# Altium project beovox-poe.PrjPcb
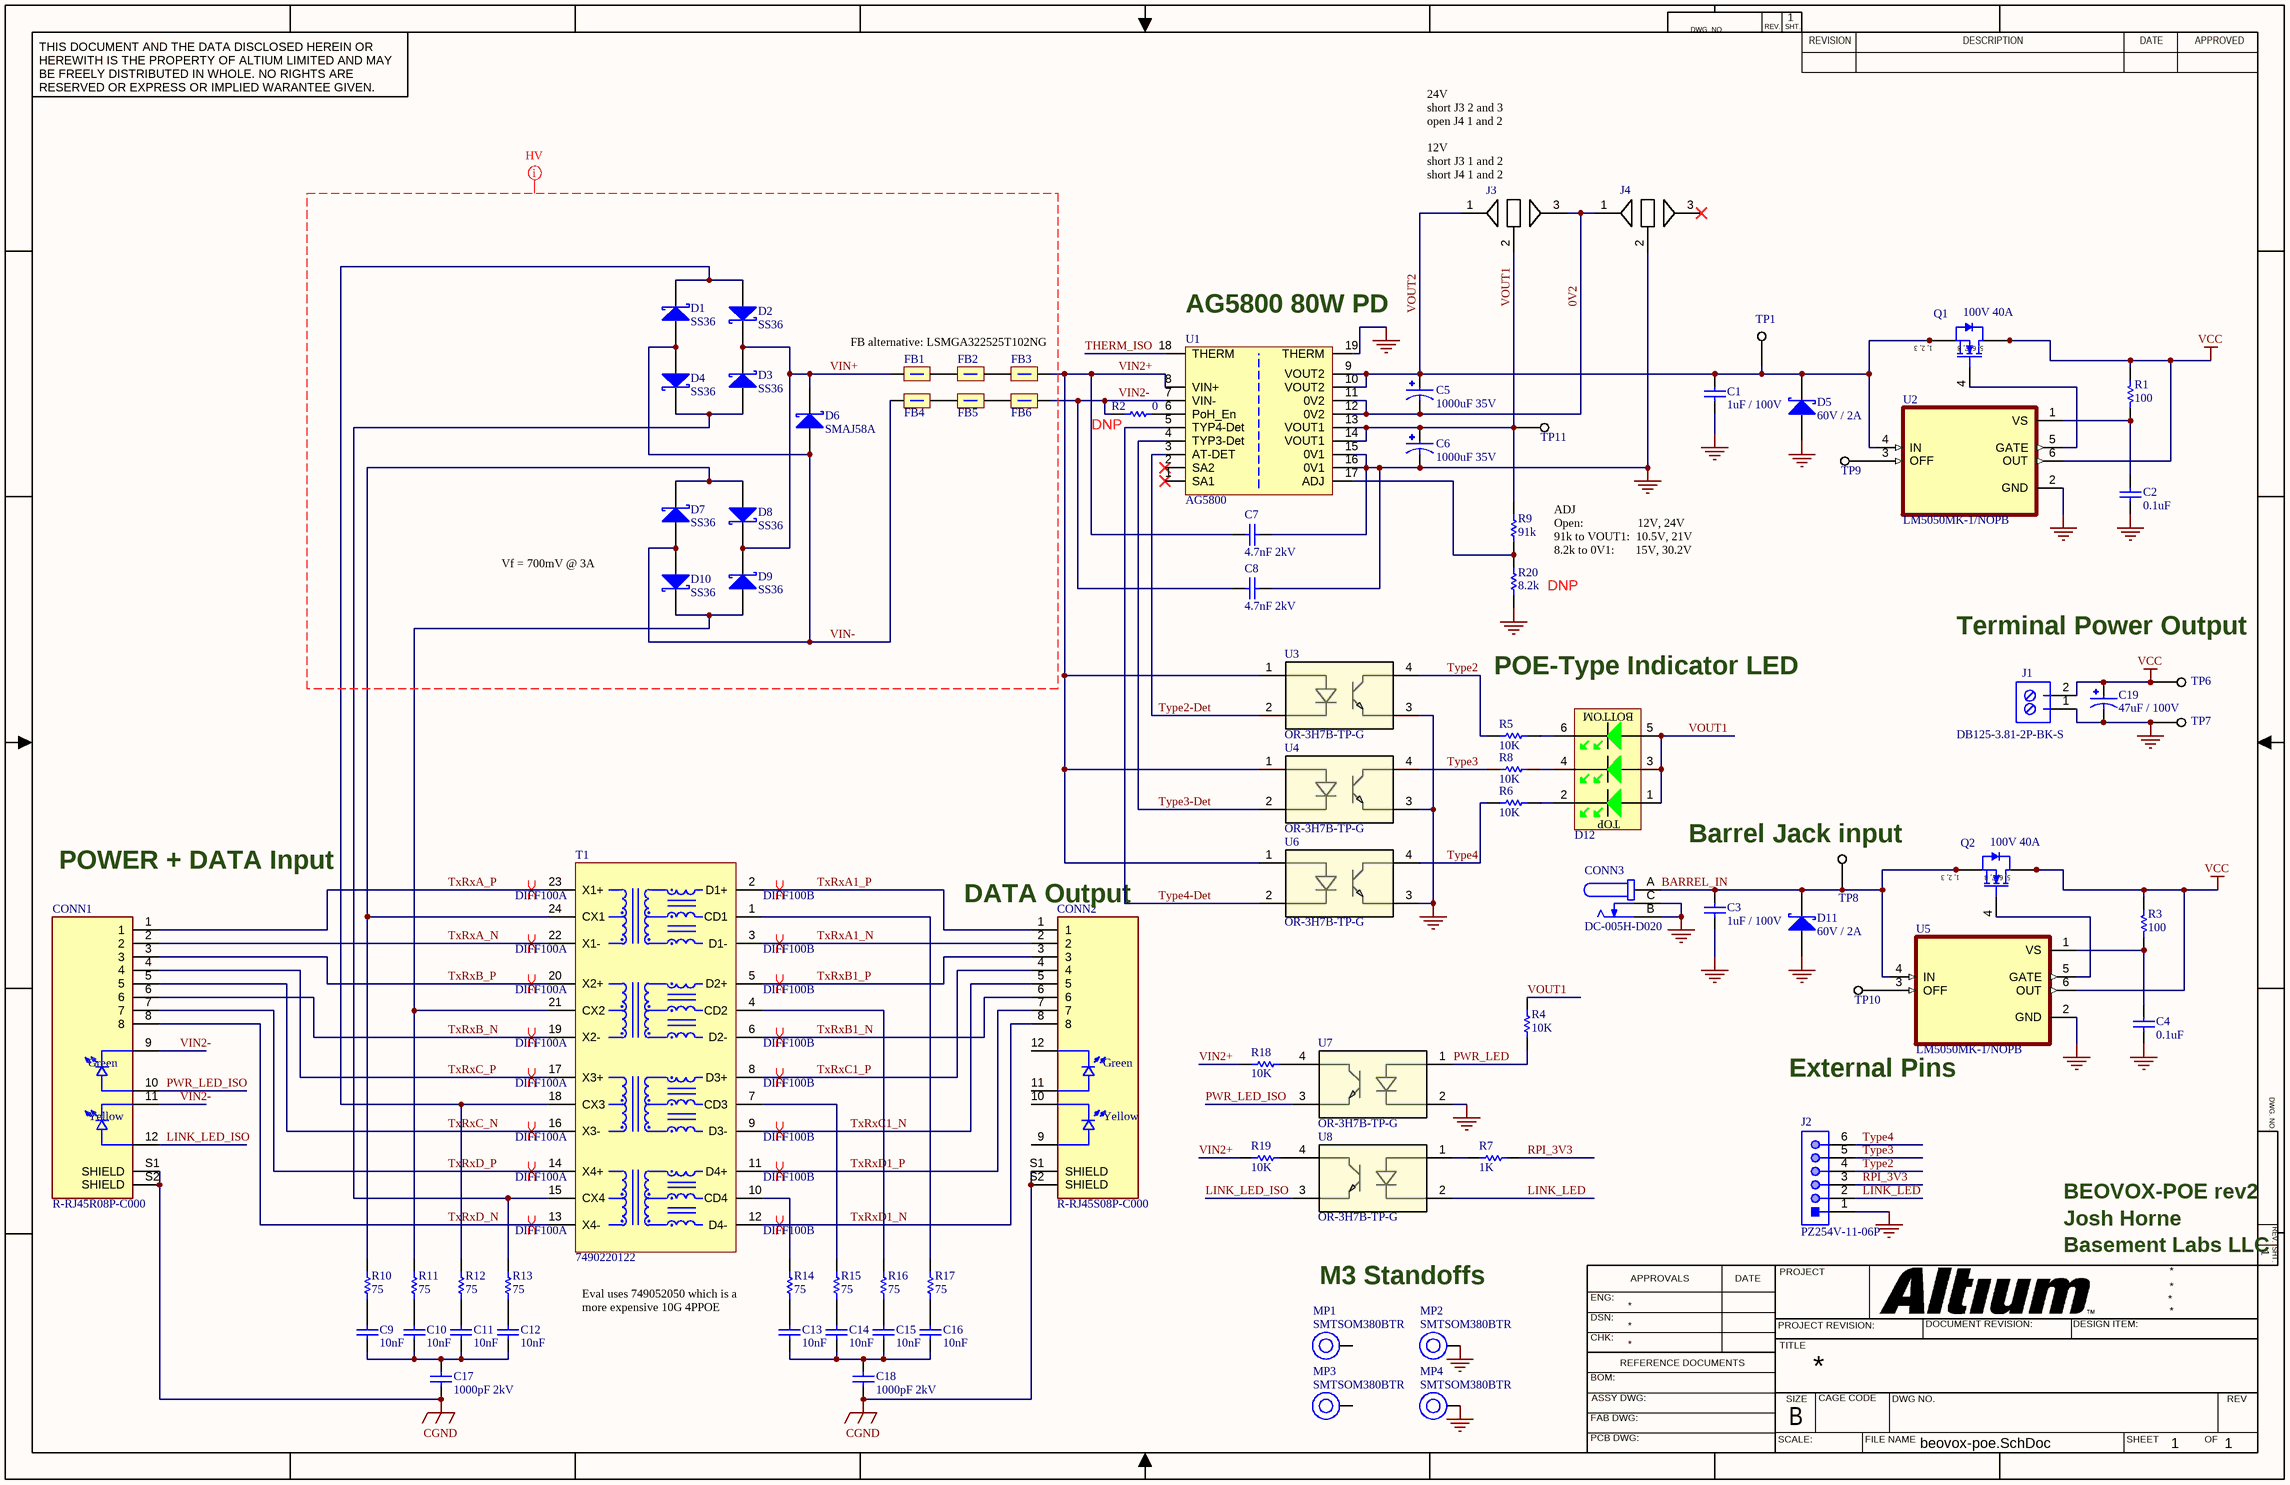
[diagram p0: beovox-poe.SchDoc]
PCB_ENGINEER: JOSH HORNE; PCB_TITLE_1: BEOVOX-POE; PCB_TITLE_2: REV1
1 sheet, 86 parts. Net scope: global (net labels, ports and power ports of the same name join across sheets).
Board file: beovox-poe.PcbDoc

## Sheet beovox-poe.SchDoc
size 431 x 279 mm; SheetNumber: 1; SheetTotal: 1

### Parts
C1  1uF / 100V  [CAP_1210]
C2  0.1uF  [CAP_0603_SK]
C3  1uF / 100V  [CAP_1210]
C4  0.1uF  [CAP_0603_SK]
C5  1000uF 35V  [CAP_TH_5_10X20]
C6  1000uF 35V  [CAP_TH_5_10X20]
C7  4.7nF 2kV  [CAP_1206_SK]
C8  4.7nF 2kV  [CAP_1206_SK]
C9  10nF  [CAP_0603_SK]
C10  10nF  [CAP_0603_SK]
C11  10nF  [CAP_0603_SK]
C12  10nF  [CAP_0603_SK]
C13  10nF  [CAP_0603_SK]
C14  10nF  [CAP_0603_SK]
C15  10nF  [CAP_0603_SK]
C16  10nF  [CAP_0603_SK]
C17  1000pF 2kV  [CAP_1206_SK]
C18  1000pF 2kV  [CAP_1206_SK]
C19  47uF / 100V  [CAP_TH_3.5_8_12]
CONN1  R-RJ45R08P-C000  [R-RJ45R08P-C000]
CONN2  R-RJ45S08P-C000  [CONN_RJ45_R-RJ45S08P-C000]
CONN3  DC-005H-D020  [TENSILITY_54-00166]
D1  SS36  [DIOD-SMA-2_V]
D2  SS36  [DIOD-SMA-2_V]
D3  SS36  [DIOD-SMA-2_V]
D4  SS36  [DIOD-SMA-2_V]
D5  60V / 2A  [DIOD-B360A_V]
D6  SMAJ58A  [DIOD-SMA-2_V]
D7  SS36  [DIOD-SMA-2_V]
D8  SS36  [DIOD-SMA-2_V]
D9  SS36  [DIOD-SMA-2_V]
D10  SS36  [DIOD-SMA-2_V]
D11  60V / 2A  [DIOD-B360A_V]
D12  3 Diode Vertical LED Green  [MHK33147CGBTD]  (value not drawn)
FB1  MPZ2012S601AT000  [FB0805]  (value not drawn)
FB2  MPZ2012S601AT000  [FB0805]  (value not drawn)
FB3  MPZ2012S601AT000  [FB0805]  (value not drawn)
FB4  MPZ2012S601AT000  [FB0805]  (value not drawn)
FB5  MPZ2012S601AT000  [FB0805]  (value not drawn)
FB6  MPZ2012S601AT000  [FB0805]  (value not drawn)
J1  DB125-3.81-2P-BK-S  [TERM_2x1_3.81_BLK]
J2  PZ254V-11-06P  [HDR_MALE_1X6_2.54]
J3  JUMPER  [SOLDER_JUMPER_3 large]  (value not drawn)
J4  JUMPER  [SOLDER_JUMPER_3 large]  (value not drawn)
MP1  SMTSOM380BTR  [SMTSOM380_PlatedScrew]
MP2  SMTSOM380BTR  [SMTSOM380_PlatedScrew]
MP3  SMTSOM380BTR  [SMTSOM380_PlatedScrew]
MP4  SMTSOM380BTR  [SMTSOM380_PlatedScrew]
Q1  100V 40A  [TRANS_8PowerTDFN]
Q2  100V 40A  [TRANS_8PowerTDFN]
R1  100  [RES_0603]
R2  0  [RES_0805]
R3  100  [RES_0603]
R4  10K  [RES_0603]
R5  10K  [RES_0603]
R6  10K  [RES_0603]
R7  1K  [RES_0603]
R8  10K  [RES_0603]
R9  91k  [RES_0603]
R10  75  [RES_0603]
R11  75  [RES_0603]
R12  75  [RES_0603]
R13  75  [RES_0603]
R14  75  [RES_0603]
R15  75  [RES_0603]
R16  75  [RES_0603]
R17  75  [RES_0603]
R18  10K  [RES_0603]
R19  10K  [RES_0603]
R20  8.2k  [RES_0603]
T1  7490220122  [XFMR_7490220122]
TP1  TP  [Test_Point]  (value not drawn)  (no BOM)
TP6  TP  [Test_Point]  (value not drawn)  (no BOM)
TP7  TP  [Test_Point]  (value not drawn)  (no BOM)
TP8  TP  [Test_Point]  (value not drawn)  (no BOM)
TP9  TP  [Test_Point]  (value not drawn)  (no BOM)
TP10  TP  [Test_Point]  (value not drawn)  (no BOM)
TP11  TP  [Test_Point]  (value not drawn)  (no BOM)
U1  AG5800  [AG5800]
U2  LM5050MK-1/NOPB  [SOT95P280X110-6N]
U3  OR-3H7B-TP-G  [SOIC_(B)(TA)-VG_EVS]
U4  OR-3H7B-TP-G  [SOIC_(B)(TA)-VG_EVS]
U5  LM5050MK-1/NOPB  [SOT95P280X110-6N]
U6  OR-3H7B-TP-G  [SOIC_(B)(TA)-VG_EVS]
U7  OR-3H7B-TP-G  [SOIC_(B)(TA)-VG_EVS]
U8  OR-3H7B-TP-G  [SOIC_(B)(TA)-VG_EVS]

### Nets
CGND: C17.1 C18.1 CONN1.S1(SHIELD) CONN1.S2(SHIELD) CONN2.S1(SHIELD) CONN2.S2(SHIELD)
GND: C1.1 C2.1 C3.1 C4.1 C6.N C7.2 C8.2 C19.N CONN3.B CONN3.C D5.1(A) D11.1(A) J1.1 J2.1 J4.2 MP2.1 MP4.1 R20.1 TP7.1 U1.15(0V1) U1.16(0V1) U1.19(THERM) U2.2(GND) U3.3 U4.3 U5.2(GND) U6.3 U7.2
VCC: C19.P J1.2 Q1.5(DRAIN) Q1.6(DRAIN) Q1.7(DRAIN) Q1.8(DRAIN) Q2.5(DRAIN) Q2.6(DRAIN) Q2.7(DRAIN) Q2.8(DRAIN) R1.2 R3.2 TP6.1 U2.6(OUT) U5.6(OUT)
0V2: C5.N J3.3 J4.1 U1.11(0V2) U1.12(0V2)
BARREL_IN: C3.2 CONN3.A D11.2(K) Q2.1(SOURCE) Q2.2(SOURCE) Q2.3(SOURCE) TP8.1 U5.4(IN)
LINK_LED: J2.2 U8.2
LINK_LED_ISO: CONN1.12 U8.3
PWR_LED: R4.1 U7.1
PWR_LED_ISO: CONN1.10 U7.3
RPI_3V3: J2.3 R7.1
THERM_ISO: U1.18(THERM)
TxRxA1_N: CONN2.2 T1.3(D1-)
TxRxA1_P: CONN2.1 T1.2(D1+)
TxRxA_N: CONN1.2 T1.22(X1-)
TxRxA_P: CONN1.1 T1.23(X1+)
TxRxB1_N: CONN2.6 T1.6(D2-)
TxRxB1_P: CONN2.3 T1.5(D2+)
TxRxB_N: CONN1.6 T1.19(X2-)
TxRxB_P: CONN1.3 T1.20(X2+)
TxRxC1_N: CONN2.5 T1.9(D3-)
TxRxC1_P: CONN2.4 T1.8(D3+)
TxRxC_N: CONN1.5 T1.16(X3-)
TxRxC_P: CONN1.4 T1.17(X3+)
TxRxD1_N: CONN2.8 T1.12(D4-)
TxRxD1_P: CONN2.7 T1.11(D4+)
TxRxD_N: CONN1.8 T1.13(X4-)
TxRxD_P: CONN1.7 T1.14(X4+)
Type2: J2.4 R5.2 U3.4
Type2-Det: U1.3(AT-DET) U3.2
Type3: J2.5 R8.2 U4.4
Type3-Det: U1.4(TYP3-Det) U4.2
Type4: J2.6 R6.2 U6.4
Type4-Det: U1.5(TYP4-Det) U6.2
VIN2+: C7.1 FB3.2 R18.2 R19.2 U1.8(VIN+) U3.1 U4.1 U6.1
VIN2-: C8.1 CONN1.9 CONN1.11 FB6.2 R2.1 U1.7(VIN-)
VIN+: D2.2(K) D3.2(K) D6.2(K) D8.2(K) D9.2(K) FB1.1
VIN-: D1.1(A) D4.1(A) D6.1(A) D7.1(A) D10.1(A) FB4.1
VOUT1: C6.P D12.1 D12.3 D12.5 J3.2 R4.2 R9.1 TP11.1 U1.13(VOUT1) U1.14(VOUT1)
VOUT2: C1.2 C5.P D5.2(K) J3.1 Q1.1(SOURCE) Q1.2(SOURCE) Q1.3(SOURCE) TP1.1 U1.9(VOUT2) U1.10(VOUT2) U2.4(IN)
NetC2_2: C2.2 R1.1 U2.1(VS)
NetC4_2: C4.2 R3.1 U5.1(VS)
NetC9_1: C9.1 C10.1 C11.1 C12.1 C17.2
NetC9_2: C9.2 R10.1
NetC10_2: C10.2 R11.1
NetC11_2: C11.2 R12.1
NetC12_2: C12.2 R13.1
NetC13_1: C13.1 C14.1 C15.1 C16.1 C18.2
NetC13_2: C13.2 R14.1
NetC14_2: C14.2 R15.1
NetC15_2: C15.2 R16.1
NetC16_2: C16.2 R17.1
NetD1_2: D1.2(K) D2.1(A) R12.2 T1.18(CX3)
NetD3_1: D3.1(A) D4.2(K) R13.2 T1.15(CX4)
NetD7_2: D7.2(K) D8.1(A) R10.2 T1.24(CX1)
NetD9_1: D9.1(A) D10.2(K) R11.2 T1.21(CX2)
NetD12_2: D12.2 R6.1
NetD12_4: D12.4 R8.1
NetD12_6: D12.6 R5.1
NetFB1_2: FB1.2 FB2.1
NetFB2_2: FB2.2 FB3.1
NetFB4_2: FB4.2 FB5.1
NetFB5_2: FB5.2 FB6.1
NetQ1_4: Q1.4(GATE) U2.5(GATE)
NetQ2_4: Q2.4(GATE) U5.5(GATE)
NetR2_2: R2.2 U1.6(PoH_En)
NetR7_2: R7.2 U8.1
NetR9_2: R9.2 R20.2 U1.17(ADJ)
NetR14_2: R14.2 T1.10(CD4)
NetR15_2: R15.2 T1.7(CD3)
NetR16_2: R16.2 T1.4(CD2)
NetR17_2: R17.2 T1.1(CD1)
NetR18_1: R18.1 U7.4
NetR19_1: R19.1 U8.4
NetTP9_1: TP9.1 U2.3(OFF)
NetTP10_1: TP10.1 U5.3(OFF)

Not connected (* = marked no-connect by the designer): CONN2 9 10 11 12; J4 3*; MP1 1; MP3 1; U1 1(SA1)* 2(SA2)*

### Layout directives
net class HV: VIN+, VIN-
differential pair; differential pair class DIFF100A: TxRxA_N, TxRxA_P, TxRxB_N, TxRxB_P, TxRxC_N, TxRxC_P, TxRxD_N, TxRxD_P
differential pair; differential pair class DIFF100B: TxRxA1_N, TxRxA1_P, TxRxB1_N, TxRxB1_P, TxRxC1_N, TxRxC1_P, TxRxD1_N, TxRxD1_P

### Notes on the sheet
- (near J3) 24V
  short J3 2 and 3
  open J4 1 and 2
  12V
  short J3 1 and 2
  short J4 1 and 2
- FB alternative: LSMGA322525T102NG
- (near U1) AG5800 80W PD
- (near R2) DNP
- ADJ
  Open:                  12V, 24V
  91k to VOUT1:  10.5V, 21V
  8.2k to 0V1:       15V, 30.2V
- Vf = 700mV @ 3A
- DNP
- POE-Type Indicator LED
- Terminal Power Output
- POWER + DATA Input
- (near TP8) Barrel Jack input
- (near CONN2) DATA Output
- External Pins
- BEOVOX-POE rev2
- Josh Horne
- M3 Standoffs
- Basement Labs LLC
- Eval uses 749052050 which is a more expensive 10G 4PPOE
- DWG. NO.
- REV.
- SHT.
- THIS DOCUMENT AND THE DATA DISCLOSED HEREIN OR HEREWITH IS THE PROPERTY OF ALTIUM LIMITED AND MAY BE FREELY DISTRIBUTED IN WHOLE. NO RIGHTS ARE RESERVED OR EXPRESS OR IMPLIED WARANTEE GIVEN.
- REVISION
- DESCRIPTION
- DATE
- APPROVED
- ENG:
- APPROVALS
- PROJECT
- DSN:
- CHK:
- REFERENCE DOCUMENTS
- PROJECT REVISION:
- TITLE
- DOCUMENT REVISION:
- DESIGN ITEM:
- BOM:
- FAB DWG:
- PCB DWG:
- ASSY DWG:
- SCALE:
- SIZE
- B
- CAGE CODE
- FILE NAME
- DWG NO.
- SHEET
- OF
- REV
- (in symbol BSZ097N10NS5ATMA1) 1, 2, 3; 5, 6, 7, 8
- (in symbol MHK33147CGBTD) BOTTOM; TOP
- (in symbol R-RJ45R08P-C000) Green; Yellow
- (in symbol R-RJ45S08P-C000) Green; Yellow

### Library data of the parts
C1 C3 = GRM32ER72A105KA01L: 1210 1 uF 100 V ±10% Tolerance X7R SMT Multilayer Ceramic Capacitor; Manufacturer: Murata; Supplier 1: Avnet; Manufacturer Part Number: GRM32ER72A105KA01L; RoHS: Yes; Category: Ceramic Capacitors; Stock 1: 22500; Pricing 1: 1000=0.33337, 2000=0.32553, 4000=0.31768, 6000=0.30984, 8000=0.30199 (USD); Mount: Surface Mount; Case/Package: 1210; Number of Pins: 2; Case Code (Imperial): 1210; Case Code (Metric): 3225; Material: Ceramic; Min Operating Temperature: -55°C; Max Operating Temperature: 125°C; Capacitance: 1uF; Tolerance: 10%; Dielectric: X7R; Voltage Rating: 100V; Packaging: Tape and Reel; Package Quantity: 1; Termination: SMD/SMT; Voltage: 100V; Voltage Rating (DC): 100V; Series: GRM; Length: 3.2mm; Width: 0.098inch; Height: 2.5mm; Thickness: 0.106inch; Depth: 2.5mm; Reach SVHC Compliant: Yes; Lead Free: Lead Free; RoHS Compliant: Yes; ComponentLink1URL: https://datasheet.ciiva.com/11789/0900766b80ef921d-11789096.pdf?src-supplier=RSComponents; ComponentLink1Description: https://datasheet.ciiva.com/11789/0900766b80ef921d-11789096.pdf?src-supplier=RSComponents; ComponentLink2URL: https://datasheet.ciiva.com/3777/2750grm32er72a105ka0123-3777235.pdf?src-supplier=Arrow+Electronics; ComponentLink2Description: https://datasheet.ciiva.com/3777/2750grm32er72a105ka0123-3777235.pdf?src-supplier=Arrow+Electronics; ComponentLink3URL: https://datasheet.ciiva.com/29202/451519-da-01-de-vs-kondens-grm32-er72a-105ka01l-29202131.pdf?src-supplier=Conrad; ComponentLink3Description: https://datasheet.ciiva.com/29202/451519-da-01-de-vs-kondens-grm32-er72a-105ka01l-29202131.pdf?src-supplier=Conrad; ComponentLink4URL: https://datasheet.ciiva.com/7937/608985-7937781.pdf?src-supplier=Element14; ComponentLink4Description: https://datasheet.ciiva.com/7937/608985-7937781.pdf?src-supplier=Element14; ComponentLink5URL: https://datasheet.ciiva.com/22703/608985-22703400.pdf?src-supplier=Element14; ComponentLink5Description: https://datasheet.ciiva.com/22703/608985-22703400.pdf?src-supplier=Element14; ComponentLink6URL: https://datasheet.ciiva.com/141/partnumbering-e-01-141963.pdf?src-supplier=Digi-Key; ComponentLink6Description: https://datasheet.ciiva.com/141/partnumbering-e-01-141963.pdf?src-supplier=Digi-Key; ComponentLink7URL: https://datasheet.ciiva.com/141/partnumbering-e-01-141962.pdf?src-supplier=Digi-Key; ComponentLink7Description: https://datasheet.ciiva.com/141/partnumbering-e-01-141962.pdf?src-supplier=Digi-Key; ComponentLink8URL: https://datasheet.ciiva.com/141/partnumbering-e-01-141964.pdf?src-supplier=Digi-Key; ComponentLink8Description: https://datasheet.ciiva.com/141/partnumbering-e-01-141964.pdf?src-supplier=Digi-Key; ComponentLink9URL: https://datasheet.ciiva.com/5415/product-5415622.pdf?src-supplier=Mouser; ComponentLink9Description: https://datasheet.ciiva.com/5415/product-5415622.pdf?src-supplier=Mouser; ComponentLink10URL: https://datasheet.ciiva.com/16376/c02e-16376506.pdf?src-supplier=Future+Electronics; ComponentLink10Description: https://datasheet.ciiva.com/16376/c02e-16376506.pdf?src-supplier=Future+Electronics; Supplier Part Number 1: GRM32ER72A105KA01L
C2 C4 = CC0603KRX7R0BB104: 0603 0.1 uF 100 V ±10% Tolerance X7R Multilayer Ceramic Capacitor; Manufacturer: Yageo; Capacitance: 100nF; Voltage Rating: 100V; Supplier 1: Arrow Electronics; Manufacturer Part Number: CC0603KRX7R0BB104; RoHS: Yes; Category: Ceramic Capacitors; Stock 1: 2; Pricing 1: 1=0.01580 (USD); Mount: Surface Mount; Case/Package: 0603; Case Code (Metric): 1608; Case Code (Imperial): 0603; Weight: 7.1E-05oz; Min Operating Temperature: -55°C; Max Operating Temperature: 125°C; Package Quantity: 4000; Tolerance: 10%; Packaging: Tape and Reel; Dielectric: X7R; Termination: SMD/SMT; Resistor Type: Ceramic; Voltage Rating (DC): 100V; Series: CC; Length: 0.063inch; Width: 0.031inch; Thickness: 0.035inch; Depth: 0.8mm; Lead Free: Lead Free; RoHS Compliant: Yes; ComponentLink1URL: https://datasheet.ciiva.com/6277/mlccorderingcode-6277082.pdf?src-supplier=Digi-Key; ComponentLink1Description: https://datasheet.ciiva.com/6277/mlccorderingcode-6277082.pdf?src-supplier=Digi-Key; ComponentLink2URL: https://datasheet.ciiva.com/6277/mlccorderingcode-6277081.pdf?src-supplier=Digi-Key; ComponentLink2Description: https://datasheet.ciiva.com/6277/mlccorderingcode-6277081.pdf?src-supplier=Digi-Key; ComponentLink3URL: https://datasheet.ciiva.com/6277/mlccorderingcode-6277030.pdf?src-supplier=Digi-Key; ComponentLink3Description: https://datasheet.ciiva.com/6277/mlccorderingcode-6277030.pdf?src-supplier=Digi-Key; Supplier Part Number 1: CC0603KRX7R0BB104; ComponentLink4Description: LCSC; ComponentLink4URL: https://www.lcsc.com/product-detail/Multilayer-Ceramic-Capacitors-MLCC-SMD-SMT_YAGEO-CC0603KRX7R0BB104_C113803.html; Supplier: LCSC; Supplier Part Number: C113803
C5 C6 = ERR1VM102G20OT: 1000uF 35V ±20% Plugin,D10xL20mm Aluminum Electrolytic Capacitors - Leaded ROHS; Manufacturer: AISHI; Supplier: LCSC; Supplier Part Number: C398835; ComponentLink1Description: LCSC; ComponentLink1URL: https://www.lcsc.com/product-detail/Aluminum-Electrolytic-Capacitors-Leaded_AISHI-Aihua-Group-ERR1VM102G20OT_C398835.html; Manufacturer Part Number: ERR1VM102G20OT; Value: 1000uF; Voltage: 35V
C7 C8 = 1206B472K202NT: 2kV 4700pF X7R ±10% 1206 Multilayer Ceramic Capacitors MLCC - SMD/SMT ROHS; Manufacturer: FH (Guangdong Fenghua Advanced Tech); Supplier: LCSC; Supplier Part Number: C41017; Manufacturer Part Number: 1206B472K202NT; ComponentLink1Description: LCSC; ComponentLink1URL: https://www.lcsc.com/product-detail/Multilayer-Ceramic-Capacitors-MLCC-SMD-SMT_FH-Guangdong-Fenghua-Advanced-Tech-1206B472K202NT_C41017.html
C9-C16 = 0603B103K101CT: Multilayer Ceramic Capacitor, 0.01 F, 10%, X7R, 100 V, 0603 [1608 Metric] Rohs Compliant: Yes; Manufacturer: Walsin Technologies; Voltage Rating: 100V; Supplier 1: Arrow Electronics; Manufacturer Part Number: 0603B103K101CT; RoHS: Yes; Category: Ceramic Capacitors; Stock 1: 100000; Pricing 1: 4000=0.00810, 8000=0.00720, 12000=0.00620, 40000=0.00610 (USD); Case/Package: 0603; Case Code (Metric): 1608; Case Code (Imperial): 0603; Min Operating Temperature: -55°C; Max Operating Temperature: 125°C; Capacitance: 10nF; Tolerance: 10%; Packaging: Tape and Reel; Dielectric: X7R; Voltage Rating (DC): 100V; Length: 1.6mm; Depth: 0.8mm; RoHS Compliant: Yes; ComponentLink1URL: http://www.farnell.com/datasheets/2340522.pdf?src-supplier=Farnell; ComponentLink1Description: http://www.farnell.com/datasheets/2340522.pdf?src-supplier=Farnell; ComponentLink2URL: http://www.passivecomponent.com/wp-content/uploads/2018/10/MLCC.pdf?src-supplier=Digi-Key; ComponentLink2Description: http://www.passivecomponent.com/wp-content/uploads/2018/10/MLCC.pdf?src-supplier=Digi-Key; ComponentLink3URL: http://www.passivecomponent.com/indexsea/0603B103K101CT-IS.pdf?src-supplier=Digi-Key; ComponentLink3Description: http://www.passivecomponent.com/indexsea/0603B103K101CT-IS.pdf?src-supplier=Digi-Key; Supplier Part Number 1: 0603B103K101CT; ComponentLink4Description: http://www.farnell.com/datasheets/2340522.pdf?src-supplier=Element14; ComponentLink4URL: http://www.farnell.com/datasheets/2340522.pdf?src-supplier=Element14; Supplier: LCSC; Supplier Part Number: C302008; REACH SVHC: Unknown; ComponentLink5URL: http://www.farnell.com/datasheets/2340522.pdf?src-supplier=Newark; ComponentLink5Description: http://www.farnell.com/datasheets/2340522.pdf?src-supplier=Newark; ComponentLink6Description: LCSC; ComponentLink6URL: https://www.lcsc.com/product-detail/Multilayer-Ceramic-Capacitors-MLCC-SMD-SMT_Walsin-Tech-Corp-0603B103K101CT_C302008.html
C17 C18 = CC1206KKX7RDBB102: Multilayer Ceramic Capacitor, 1000 pF, 2000 V, ± 10%, X7R, 1206 [3216 Metric]; Manufacturer: Yageo; Material: 4241ConductorMaterial; Capacitance: 1nF; Dissipation Factor: 2.5%; Insulation Resistance: 10GR; Supplier 1: Future Electronics; Manufacturer Part Number: CC1206KKX7RDBB102; RoHS: Yes; Category: Ceramic Capacitors; Stock 1: 1107000; Pricing 1: 3000=0.0177, 9000=0.0171, 30000=0.0164, 60000=0.016, 120000=0.0154 (USD); Mount: Surface Mount; Case/Package: 1206; Number of Pins: 2; Case Code (Metric): 3216; Case Code (Imperial): 1206; Min Operating Temperature: -55°C; Max Operating Temperature: 125°C; Tolerance: 10%; Dielectric: X7R; Packaging: Tape and Reel; Termination: SMD/SMT; Voltage: 2kV; Package Quantity: 1; Voltage Rating: 2kV; Voltage Rating (DC): 2kV; Series: CC; Construction: Flat; Length: 3.2mm; Width: 0.063inch; Height: 1.25mm; Depth: 1.6mm; Thickness: 0.057inch; Radiation Hardening: No; RoHS Compliant: Yes; Lead Free: Lead Free; Reach SVHC Compliant: Unknown; ComponentLink1URL: https://datasheet.ciiva.com/23942/1449957-23942422.pdf?src-supplier=Newark; ComponentLink1Description: https://datasheet.ciiva.com/23942/1449957-23942422.pdf?src-supplier=Newark; ComponentLink2URL: https://datasheet.ciiva.com/186/upy-np0x7r-hv-1kv-to-3kv-4-186736.pdf?src-supplier=Digi-Key; ComponentLink2Description: https://datasheet.ciiva.com/186/upy-np0x7r-hv-1kv-to-3kv-4-186736.pdf?src-supplier=Digi-Key; ComponentLink3URL: https://datasheet.ciiva.com/186/upy-np0x7r-hv-1kv-to-3kv-4-186735.pdf?src-supplier=Digi-Key; ComponentLink3Description: https://datasheet.ciiva.com/186/upy-np0x7r-hv-1kv-to-3kv-4-186735.pdf?src-supplier=Digi-Key; ComponentLink4URL: https://datasheet.ciiva.com/186/upy-np0x7r-hv-1kv-to-3kv-4-186737.pdf?src-supplier=Digi-Key; ComponentLink4Description: https://datasheet.ciiva.com/186/upy-np0x7r-hv-1kv-to-3kv-4-186737.pdf?src-supplier=Digi-Key; ComponentLink5URL: https://datasheet.ciiva.com/13386/upy-gp-np0-16v-to-50v-8-13386312.pdf?src-supplier=Mouser; ComponentLink5Description: https://datasheet.ciiva.com/13386/upy-gp-np0-16v-to-50v-8-13386312.pdf?src-supplier=Mouser; Supplier Part Number 1: 2008092; Supplier: LCSC; Supplier Part Number: C23631; Value: 1000pF 2kV; ComponentLink6Description: LCSC; ComponentLink6URL: https://www.lcsc.com/product-detail/Multilayer-Ceramic-Capacitors-MLCC-SMD-SMT_YAGEO-CC1206KKX7RDBB102_C23631.html
C19 = ERS1KM470F12OT: 47uF 100V ±20% Plugin,D8xL12mm Aluminum Electrolytic Capacitors - Leaded ROHS; Manufacturer: AISHI(Aihua Group); Manufacturer Part Number: ERS1KM470F12OT; Supplier: LCSC; Supplier Part Number: C106688; ComponentLink1Description: LCSC; ComponentLink1URL: https://www.lcsc.com/product-detail/Aluminum-Electrolytic-Capacitors-Leaded_AISHI-Aihua-Group-ERS1KM470F12OT_C106688.html
CONN1 = R-RJ45R08P-C000: RJ45 RJReceptacle 1 有屏蔽 Right-Angle WithLED 0℃~+70℃ Plugin Ethernet Connectors/Modular Connectors (RJ45 RJ11) ROHS; Manufacturer: Ckmtw; Supplier: LCSC; Supplier Part Number: C386757; Manufacturer Part Number: R-RJ45R08P-C000; ComponentLink1Description: LCSC; ComponentLink1URL: https://www.lcsc.com/product-detail/Ethernet-Connectors-Modular-Connectors-RJ45-RJ11_Ckmtw-Shenzhen-Cankemeng-R-RJ45R08P-C000_C386757.html
CONN2 = R-RJ45S08P-C000: RJ45 RJReceptacle 1 有屏蔽 Straight WithLED 0℃~+70℃ Plugin Ethernet Connectors/Modular Connectors (RJ45 RJ11) ROHS; Manufacturer: Ckmtw(Shenzhen Cankemeng); Supplier: LCSC; Supplier Part Number: C386764; Manufacturer Part Number: R-RJ45S08P-C000; ComponentLink1Description: LCSC; ComponentLink1URL: https://www.lcsc.com/product-detail/Ethernet-Connectors-Modular-Connectors-RJ45-RJ11_Ckmtw-Shenzhen-Cankemeng-R-RJ45S08P-C000_C386764.html
CONN3 = DC-005H-D020: Right-Angle DC Power Receptacle -30℃~+85℃ 2mm 5.8mm 7A 35V Plugin AC/DC Power Connectors ROHS; Manufacturer: G-Switch; Supplier: LCSC; Supplier Part Number: C5155559; Manufacturer Part Number: DC-005H-D020; ComponentLink1Description: LCSC; ComponentLink1URL: https://www.lcsc.com/product-detail/AC-DC-Power-Connectors_G-Switch-DC-005H-D020_C5155559.html
D1-D4 D7-D10 = SS36: 60V 700mV@3A 3A SMA(DO-214AC) Schottky Barrier Diodes (SBD) ROHS; Manufacturer: MDD; Value: 60V 3A; Supplier: LCSC; Supplier Part Number: C16015; Manufacturer Part Number: SS36; ComponentLink1Description: LCSC; ComponentLink1URL: https://www.lcsc.com/product-detail/Schottky-Barrier-Diodes-SBD_MDD-Microdiode-Electronics-SS36_C16015.html
D5 D11 = B260-13-F: VR=60V IF=2A 200pF; Manufacturer: Diodes; Max Reverse Current: 500uA; Peak Non-Repetitive Surge Current: 50A; Element Configuration: Single; Forward Voltage: 700mV; Polarity: Standard; Supplier 1: Newark; Manufacturer Part Number: B260-13-F; RoHS: Yes; Category: Rectifier Diodes; Stock 1: 2763; Pricing 1: 1=0.45000, 5=0.45000, 10=0.36200, 25=0.32300, 50=0.28500, 100=0.24600, 250=0.20600, 500=0.16700, 1000=0.13400 (USD); Mount: Surface Mount; Case/Package: SMB; Number of Pins: 2; Weight: 0.00328oz; Contact Plating: Tin,Matte; Min Operating Temperature: -65°C; Max Operating Temperature: 150°C; Forward Current: 2A; Max Repetitive Reverse Voltage (Vrrm): 60V; Package Quantity: 3000; Packaging: Cut Tape; Average Rectified Current: 2A; Max Forward Surge Current (Ifsm): 50A; Termination: SMD/SMT; Voltage Rating (DC): 60V; Current Rating: 2A; Capacitance: 200pF; Output Current: 2A; Current: 2A; Voltage: 60V; Max Reverse Voltage (DC): 60V; Series: -; Length: 4.57mm; Width: 3.94mm; Height: 2.62mm; Radiation Hardening: No; Reach SVHC Compliant: Yes; Lead Free: Lead Free; RoHS Compliant: Yes; ComponentLink1URL: https://datasheet.ciiva.com/26949/getdatasheetpartid-116011-26949343.pdf?src-supplier=Verical; ComponentLink1Description: https://datasheet.ciiva.com/26949/getdatasheetpartid-116011-26949343.pdf?src-supplier=Verical; ComponentLink2URL: https://datasheet.ciiva.com/16199/ds13004-16199944.pdf?src-supplier=Future+Electronics; ComponentLink2Description: https://datasheet.ciiva.com/16199/ds13004-16199944.pdf?src-supplier=Future+Electronics; ComponentLink3URL: https://datasheet.ciiva.com/4715/ds13004-70120-4715821.pdf?src-supplier=Mouser; ComponentLink3Description: https://datasheet.ciiva.com/4715/ds13004-70120-4715821.pdf?src-supplier=Mouser; Supplier Part Number 1: 23T4612; Supplier: LCSC; Supplier Part Number: C72265; ComponentLink4Description: LCSC; ComponentLink4URL: https://www.lcsc.com/product-detail/Schottky-Barrier-Diodes-SBD_Diodes-Incorporated-B260-13-F_C72265.html
D6 = SMAJ58A: 4.3A 400W 93.6V 64.4V 58V SMA(DO-214AC) TVS ROHS; Manufacturer: GOODWORK; Value: 58V 400W; Manufacturer Part Number: SMAJ58A; Supplier: LCSC; Supplier Part Number: C2980408; ComponentLink1Description: LCSC; ComponentLink1URL: https://www.lcsc.com/product-detail/TVS_GOODWORK-SMAJ58A_C2980408.html
D12 = MHK33147CGBTD: 20mA 30mcd 雾状绿透镜 -40℃~+85℃ 568nm Green 60° 2.6V DIP-6-2.54mm Light Emitting Diodes (LED) ROHS; Manufacturer: MEIHUA; ComponentLink1Description: LCSC; ComponentLink1URL: https://www.lcsc.com/product-detail/Light-Emitting-Diodes-LED_MEIHUA-MHK33147CGBTD_C7470849.html; Manufacturer Part Number: MHK33147CGBTD; Supplier: LCSC; Supplier Part Number: C7470849
FB1-FB6 = MPZ2012S601AT000: Ferrite Beads Multi-Layer Power 600Ohm 25% 100MHz 2A 100mOhm DCR 0805 T/R; Manufacturer: TDK; Impedance: 600R; DC Resistance (DCR): 100mR; Number of Lines: 1; Supplier 1: Digi-Key; Manufacturer Part Number: MPZ2012S601AT000; RoHS: Yes; Category: Ferrite Beads and Chips; Stock 1: 54486; Pricing 1: 1=0.12, 10=0.094, 25=0.0848, 50=0.0622, 100=0.0537, 250=0.0424, 500=0.03582, 1000=0.03016 (USD); Mount: Surface Mount; Case/Package: 0805; Case Code (Metric): 2012; Case Code (Imperial): 0805; Core Material: Ferrite; Min Operating Temperature: -55°C; Max Operating Temperature: 125°C; Packaging: Tape and Reel; Package Quantity: 1; Current Rating: 2A; Max DC Current: 2A; Series: MPZ; Test Frequency: 100MHz; Tolerance: 25%; Max Current Rating: 2A; RMS Current (Irms): 2A; Series Resistance: 100mR; Length: 0.079inch; Width: 0.049inch; Height: 0.041inch; Reach SVHC Compliant: No; Lead Free: Lead Free; RoHS Compliant: Yes; ComponentLink1URL: https://datasheet.ciiva.com/46634/beads-commercial-power-mpz-en-46634335.pdf?src-supplier=Digi-Key; ComponentLink1Description: https://datasheet.ciiva.com/46634/beads-commercial-power-mpz-en-46634335.pdf?src-supplier=Digi-Key; ComponentLink2URL: https://datasheet.ciiva.com/46634/beads-commercial-power-mpz-en-46634377.pdf?src-supplier=Digi-Key; ComponentLink2Description: https://datasheet.ciiva.com/46634/beads-commercial-power-mpz-en-46634377.pdf?src-supplier=Digi-Key; ComponentLink3URL: https://datasheet.ciiva.com/46634/beads-commercial-power-mpz-en-46634606.pdf?src-supplier=Digi-Key; ComponentLink3Description: https://datasheet.ciiva.com/46634/beads-commercial-power-mpz-en-46634606.pdf?src-supplier=Digi-Key; Supplier Part Number 1: 445-MPZ2012S601AT000CT-ND; Supplier: LCSC; Supplier Part Number: C21519; ComponentLink4Description: LCSC; ComponentLink4URL: https://www.lcsc.com/product-detail/Ferrite-Beads_TDK-MPZ2012S601AT000_C21519.html
J1 = DB125-3.81-2P-BK-S: 1x2P 10A -40℃~+105℃ 300V Black 16~26 Straight 3.81mm 0.5~1 1 2 Plugin,P=3.81mm Screw terminal ROHS; Manufacturer: Dorabo; ComponentLink1Description: LCSC; ComponentLink1URL: https://www.lcsc.com/product-detail/Screw-terminal_DORABO-DB125-3-81-2P-BK-S_C430618.html; Supplier: LCSC; Supplier Part Number: C430618; Manufacturer Part Number: DB125-3.81-2P-BK-S
J2 = PZ254V-11-06P: Straight Square Pins 2.5mm 6P 6mm -40℃~+105℃ 3mm 2.54mm Plugin Black Brass 1x6P Plugin,P=2.54mm Pin Headers ROHS; Manufacturer: XFCN; ComponentLink1Description: LCSC; ComponentLink1URL: https://www.lcsc.com/product-detail/Pin-Headers_XFCN-PZ254V-11-06P_C492405.html; Supplier: LCSC; Supplier Part Number: C492405; Manufacurer Part Number: PZ254V-11-06P
J3 J4 = Solder_Jumper_3
MP1-MP4 = SMTSOM380BTR: M3 Round Nut 8mm height; Manufacturer: YIYUAN; Supplier: LCSC; Supplier Part Number: C5301772; ComponentLink1Description: LCSC; ComponentLink1URL: https://www.lcsc.com/product-detail/Other-nuts_YIYUAN-SMTSOM380BTR_C5301772.html; Manufacturer Part Number: SMTSOM380BTR
Q1 Q2 = BSZ097N10NS5ATMA1: BSZ097xx Series 100 V 40 A 9.7 mOhm OptiMOS5 Power-MOSFET - TSDSON-8 FL; Manufacturer: Infineon; Rds On Max: 9.7mR; Input Capacitance: 2.08nF; Max Power Dissipation: 69W; Number of Channels: 1; Drain to Source Resistance: 13mR; Gate to Source Voltage (Vgs): 20V; Fall Time: 5ns; Turn-Off Delay Time: 21ns; Turn-On Delay Time: 11ns; Polarity: N-CHANNEL; Supplier 1: Mouser; Manufacturer Part Number: BSZ097N10NS5ATMA1; RoHS: Yes; Category: MOSFETs; Stock 1: 24743; Pricing 1: 1=1.81, 10=1.5, 50=1.5, 100=1.2, 1000=0.892, 10000=0.757 (USD); Mount: Surface Mount; Number of Pins: 8; Min Operating Temperature: -55°C; Max Operating Temperature: 150°C; Packaging: Tape and Reel; Drain to Source Voltage (Vdss): 100V; Continuous Drain Current (ID): 40A; Rise Time: 5ns; Package Quantity: 5000; Max Dual Supply Voltage: 100V; Series: OptiMOS™; On-State Resistance: 9.7mR; Power Dissipation: 69W; Lead Free: Contains Lead; Halogen Free: Halogen Free; RoHS Compliant: Yes; ComponentLink1URL: http://www.mouser.com/ds/2/196/Infineon-BSZ097N10NS5-DS-v02_01-en-531392.pdf?src-supplier=Mouser; ComponentLink1Description: http://www.mouser.com/ds/2/196/Infineon-BSZ097N10NS5-DS-v02_01-en-531392.pdf?src-supplier=Mouser; ComponentLink2URL: http://www.farnell.com/datasheets/2255497.pdf?src-supplier=Farnell; ComponentLink2Description: http://www.farnell.com/datasheets/2255497.pdf?src-supplier=Farnell; ComponentLink3URL: https://www.infineon.com/dgdl/Infineon-BSZ097N10NS5-DS-v02_01-en.pdf?fileId=5546d461454603990145d5a1b051648d&src-supplier=Digikey; ComponentLink3Description: https://www.infineon.com/dgdl/Infineon-BSZ097N10NS5-DS-v02_01-en.pdf?fileId=5546d461454603990145d5a1b051648d&src-supplier=Digikey; ComponentLink4URL: http://www.infineon.com/dgdl/Infineon-BSZ097N10NS5-DS-v02_01-en.pdf?fileId=5546d461454603990145d5a1b051648d&src-supplier=Digikey; ComponentLink4Description: http://www.infineon.com/dgdl/Infineon-BSZ097N10NS5-DS-v02_01-en.pdf?fileId=5546d461454603990145d5a1b051648d&src-supplier=Digikey; Supplier Part Number 1: 726-BSZ097N10NS5
R1 R3 = RC0603FR-07100RL: Res Thick Film 0603 100 Ohm 1% 1/10W ±100ppm/°C Molded SMD Paper T/R; Manufacturer: Yageo; Resistance: 100R; Power Rating: 100mW; Voltage Rating (DC): 50V; Supplier 1: Future Electronics; Manufacturer Part Number: RC0603FR-07100RL; RoHS: Yes; Category: Chip SMD Resistors; Stock 1: 13935000; Pricing 1: 5000=0.00150, 50000=0.00140, 200000=0.00140, 625000=0.00130, 2000000=0.00120 (USD); Case/Package: 0603; Number of Pins: 2; Case Code (Imperial): 0603; Case Code (Metric): 1608; Size Code: 0603; Min Operating Temperature: -55°C; Max Operating Temperature: 155°C; Tolerance: 1%; Temperature Coefficient: 100ppm/°C; Resistor Type: Thick Film; Voltage Rating: 50V; Packaging: Tape and Reel; Termination: SMD/SMT; Features: Moisture Resistant; Series: RC; Max Power Dissipation: 100mW; Number of Terminations: 2; Construction: Rectangular; Resistance Tolerance: 1%; Technology: THICK FILM; Length: 1.6mm; Width: 0.8mm; Height: 0.45mm; Depth: 0.8mm; RoHS Compliant: Yes; Military Standard: Not; Lead Free: Lead Free; ComponentLink1URL: https://datasheet.ciiva.com/7660/38590-7660788.pdf?src-supplier=Element14; ComponentLink1Description: https://datasheet.ciiva.com/7660/38590-7660788.pdf?src-supplier=Element14; ComponentLink2URL: https://datasheet.ciiva.com/11808/0900766b80f96399-11808280.pdf?src-supplier=Rs; ComponentLink2Description: https://datasheet.ciiva.com/11808/0900766b80f96399-11808280.pdf?src-supplier=Rs; ComponentLink3URL: https://datasheet.ciiva.com/22747/443971-22747518.pdf?src-supplier=Element14; ComponentLink3Description: https://datasheet.ciiva.com/22747/443971-22747518.pdf?src-supplier=Element14; ComponentLink4URL: https://datasheet.ciiva.com/46440/1868787-46440890.pdf?src-supplier=Element14; ComponentLink4Description: https://datasheet.ciiva.com/46440/1868787-46440890.pdf?src-supplier=Element14; ComponentLink5URL: https://datasheet.ciiva.com/7746/1738695-7746238.pdf?src-supplier=Element14; ComponentLink5Description: https://datasheet.ciiva.com/7746/1738695-7746238.pdf?src-supplier=Element14; ComponentLink6URL: https://datasheet.ciiva.com/7746/1738695-7746237.pdf?src-supplier=Element14; ComponentLink6Description: https://datasheet.ciiva.com/7746/1738695-7746237.pdf?src-supplier=Element14; Supplier Part Number 1: 7334493; Supplier: LCSC; Supplier Part Number: C105588; ComponentLink7Description: LCSC; ComponentLink7URL: https://www.lcsc.com/product-detail/Chip-Resistor-Surface-Mount_YAGEO-RC0603FR-07100RL_C105588.html
R2 = RC0805JR-070RL: Surface Mount Thick Film Resistor, RC Series, 125 mW, - 5%, 150 V, 0805 [2012 Metric]; Manufacturer: Yageo; Resistance: 0mR; Power Rating: 125mW; Voltage Rating: 150V; Temperature Coefficient: 200ppm/°C; Supplier 1: Arrow Electronics; Manufacturer Part Number: RC0805JR-070RL; RoHS: Yes; Category: Chip SMD Resistors; Stock 1: 5861000; Pricing 1: 5000=0.00430, 10000=0.00390, 25000=0.00350, 50000=0.00270 (USD); Case/Package: 0805; Number of Pins: 2; Contact Plating: Tin,Matte; Case Code (Imperial): 0805; Case Code (Metric): 2012; Size Code: 0805; Min Operating Temperature: -55°C; Max Operating Temperature: 155°C; Resistor Type: Thick Film; Tolerance: 5%; Packaging: Tape and Reel; Voltage Rating (DC): 150V; Termination: SMD/SMT; Features: Moisture Resistant; Series: RC; Max Power Dissipation: 125mW; Number of Terminations: 2; Construction: Rectangular; Technology: THICK FILM; Resistance Tolerance: 5%; Length: 2mm; Width: 1.25mm; Height: 0.5mm; Depth: 1.25mm; Radiation Hardening: No; RoHS Compliant: Yes; REACH SVHC: Unknown; Military Standard: Not; Lead Free: Lead Free; ComponentLink1URL: https://datasheet.ciiva.com/11819/0900766b8106beab-11819430.pdf?src-supplier=RSComponents; ComponentLink1Description: https://datasheet.ciiva.com/11819/0900766b8106beab-11819430.pdf?src-supplier=RSComponents; ComponentLink2URL: https://datasheet.ciiva.com/7941/1738694-7941861.pdf?src-supplier=Element14; ComponentLink2Description: https://datasheet.ciiva.com/7941/1738694-7941861.pdf?src-supplier=Element14; ComponentLink3URL: https://datasheet.ciiva.com/7941/1738694-7941862.pdf?src-supplier=Element14; ComponentLink3Description: https://datasheet.ciiva.com/7941/1738694-7941862.pdf?src-supplier=Element14; ComponentLink4URL: https://datasheet.ciiva.com/7941/1738694-7941863.pdf?src-supplier=Element14; ComponentLink4Description: https://datasheet.ciiva.com/7941/1738694-7941863.pdf?src-supplier=Element14; ComponentLink5URL: https://datasheet.ciiva.com/15190/getdatasheetpartid-330685-15190028.pdf?src-supplier=Verical; ComponentLink5Description: https://datasheet.ciiva.com/15190/getdatasheetpartid-330685-15190028.pdf?src-supplier=Verical; Supplier Part Number 1: RC0805JR-070RL
R4-R6 R8 R18 R19 = ERJ3EKF1002V: RES SMD 10K OHM 1% 1/10W 0603; Manufacturer: Panasonic; Resistance: 10kR; Temperature Coefficient: 100ppm/°C; Power Rating: 100mW; Voltage Rating: 75V; Supplier 1: Arrow; Supplier Part Number 1: ERJ-3EKF1002V; Manufacturer Part Number: ERJ3EKF1002V; Stock 1: 780000; Pricing 1: 5000 = 0.00810, 10000 = 0.00710, 25000 = 0.00640, 50000 = 0.00570, 125000 = 0.00550 (USD); RoHS: Yes; Mount: Surface Mount; Case/Package: 0603; Number of Pins: 2; Contact Plating: Tin; Case Code (Metric): 1608; Case Code (Imperial): 0603; Min Operating Temperature: -55°C; Max Operating Temperature: 155°C; Tolerance: 1%; Composition: Thick Film; Packaging: Tape and Reel; Package Quantity: 1; Number of Terminations: 2; Termination: SMD/SMT; Military Standard: Not; Max Power Dissipation: 100mW; Voltage Rating (DC): 75V; Features: Automotive AEC-Q200; Length: 1.6mm; Height: 0.45mm; Width: 0.031inch; Depth: 0.8mm; Radiation Hardening: No; REACH SVHC: No SVHC; Lead Free: Lead Free; ComponentLink1URL: https://datasheet.ciiva.com/16511/aoa0000ce2-16511861.pdf?src-supplier=Avnet+Asia; ComponentLink1Description: https://datasheet.ciiva.com/16511/aoa0000ce2-16511861.pdf?src-supplier=Avnet+Asia; ComponentLink2URL: https://datasheet.ciiva.com/46372/1678782-46372725.pdf?src-supplier=Element14; ComponentLink2Description: https://datasheet.ciiva.com/46372/1678782-46372725.pdf?src-supplier=Element14; ComponentLink3URL: https://datasheet.ciiva.com/7830/aoa0000ce2-7830729.pdf?src-supplier=Element14; ComponentLink3Description: https://datasheet.ciiva.com/7830/aoa0000ce2-7830729.pdf?src-supplier=Element14; ComponentLink4URL: https://datasheet.ciiva.com/48530/aoa0000ce2-48530988.pdf?src-supplier=Avnet; ComponentLink4Description: https://datasheet.ciiva.com/48530/aoa0000ce2-48530988.pdf?src-supplier=Avnet; ComponentLink5URL: https://datasheet.ciiva.com/28514/426256-28514198.pdf?src-supplier=Element14; ComponentLink5Description: https://datasheet.ciiva.com/28514/426256-28514198.pdf?src-supplier=Element14; ComponentLink6URL: https://datasheet.ciiva.com/9194/aoa0000ce2-9194199.pdf?src-supplier=Avnet; ComponentLink6Description: https://datasheet.ciiva.com/9194/aoa0000ce2-9194199.pdf?src-supplier=Avnet; ComponentLink7URL: https://datasheet.ciiva.com/17212/aoa0000ce2-17212105.pdf?src-supplier=Avnet+Europe; ComponentLink7Description: https://datasheet.ciiva.com/17212/aoa0000ce2-17212105.pdf?src-supplier=Avnet+Europe; ComponentLink8URL: https://datasheet.ciiva.com/30208/aoa0000ce2-30208985.pdf?src-supplier=Onlinecomponents.com; ComponentLink8Description: https://datasheet.ciiva.com/30208/aoa0000ce2-30208985.pdf?src-supplier=Onlinecomponents.com; ComponentLink9URL: https://datasheet.ciiva.com/24070/aoa0000ce2-24070318.pdf?src-supplier=Mouser; ComponentLink9Description: https://datasheet.ciiva.com/24070/aoa0000ce2-24070318.pdf?src-supplier=Mouser; ComponentLink10URL: https://datasheet.ciiva.com/16759/70260748-16759807.pdf?src-supplier=Allied+Electronics; ComponentLink10Description: https://datasheet.ciiva.com/16759/70260748-16759807.pdf?src-supplier=Allied+Electronics
R7 = RC0603FR-071KL: Res Thick Film 0603 1K Ohm 1% 1/10W ±100ppm/°C Molded SMD SMD Paper T/R; Manufacturer: Yageo; Resistance: 1kR; Power Rating: 100mW; Voltage Rating: 50V; Supplier 1: Future Electronics; Manufacturer Part Number: RC0603FR-071KL; RoHS: Yes; Category: Chip SMD Resistors; Stock 1: 16270000; Pricing 1: 5000=0.0015, 50000=0.0014, 200000=0.0014, 625000=0.0013, 2000000=0.0012 (USD); Case/Package: 0603; Contact Plating: Tin,Matte; Case Code (Imperial): 0603; Case Code (Metric): 1608; Size Code: 0603; Min Operating Temperature: -55°C; Max Operating Temperature: 155°C; Tolerance: 1%; Temperature Coefficient: 100ppm/°C; Resistor Type: Thick Film; Packaging: Tape and Reel; Termination: SMD/SMT; Features: Moisture Resistant; Series: RC; Max Power Dissipation: 100mW; Number of Terminations: 2; Technology: THICK FILM; Resistance Tolerance: 1%; Construction: Rectangular; Length: 1.6mm; Height: 0.45mm; Depth: 0.8mm; Reach SVHC Compliant: No; Military Standard: Not; Lead Free: Lead Free; RoHS Compliant: Yes; ComponentLink1URL: https://datasheet.ciiva.com/11808/0900766b80f96399-11808081.pdf?src-supplier=Rs; ComponentLink1Description: https://datasheet.ciiva.com/11808/0900766b80f96399-11808081.pdf?src-supplier=Rs; ComponentLink2URL: https://datasheet.ciiva.com/7746/1686128-7746280.pdf?src-supplier=Element14; ComponentLink2Description: https://datasheet.ciiva.com/7746/1686128-7746280.pdf?src-supplier=Element14; ComponentLink3URL: https://datasheet.ciiva.com/7660/1868787-7660790.pdf?src-supplier=Element14; ComponentLink3Description: https://datasheet.ciiva.com/7660/1868787-7660790.pdf?src-supplier=Element14; ComponentLink4URL: https://datasheet.ciiva.com/7983/443971-7983613.pdf?src-supplier=Element14; ComponentLink4Description: https://datasheet.ciiva.com/7983/443971-7983613.pdf?src-supplier=Element14; ComponentLink5URL: https://datasheet.ciiva.com/7746/1738695-7746281.pdf?src-supplier=Element14; ComponentLink5Description: https://datasheet.ciiva.com/7746/1738695-7746281.pdf?src-supplier=Element14; ComponentLink6URL: https://datasheet.ciiva.com/7746/1738695-7746279.pdf?src-supplier=Element14; ComponentLink6Description: https://datasheet.ciiva.com/7746/1738695-7746279.pdf?src-supplier=Element14; ComponentLink7URL: https://datasheet.ciiva.com/8896/pyu-rc0603-51-rohs-l-4-8896106.pdf?src-supplier=Avnet; ComponentLink7Description: https://datasheet.ciiva.com/8896/pyu-rc0603-51-rohs-l-4-8896106.pdf?src-supplier=Avnet; ComponentLink8URL: https://datasheet.ciiva.com/15189/getdatasheetpartid-404327-15189644.pdf?src-supplier=Verical; ComponentLink8Description: https://datasheet.ciiva.com/15189/getdatasheetpartid-404327-15189644.pdf?src-supplier=Verical; Supplier Part Number 1: 4016291; ComponentLink9Description: LCSC; ComponentLink9URL: https://www.lcsc.com/product-detail/Chip-Resistor-Surface-Mount_YAGEO-RC0603FR-071KL_C22548.html; Supplier: LCSC; Supplier Part Number: C22548
R9 = RC0603FR-0791KL: SMD Chip Resistor, 91 kOhm, ± 1%, 100 mW, 0603 [1608 Metric], Thick Film, General Purpose; Manufacturer: Yageo; Resistance: 91kR; Temperature Coefficient: 100ppm/°C; Voltage Rating (DC): 50V; Voltage Rating: 75V; Power Rating: 100mW; Supplier 1: Future Electronics; Manufacturer Part Number: RC0603FR-0791KL; RoHS: Yes; Category: Chip SMD Resistors; Stock 1: 250000; Pricing 1: 5000=0.0013, 50000=0.0013, 150000=0.0012, 375000=0.0012, 1000000=0.0011 (USD); Mount: Surface Mount; Case/Package: 0603; Case Code (Imperial): 0603; Case Code (Metric): 1608; Weight: 7.1E-05oz; Size Code: 0603; Min Operating Temperature: -55°C; Max Operating Temperature: 155°C; Packaging: Tape and Reel; Tolerance: 1%; Termination: SMD/SMT; Features: Moisture Resistant; Series: RC; Max Power Dissipation: 100mW; Number of Terminations: 2; Technology: THICK FILM; Construction: Rectangular; Length: 1.6mm; Width: 0.8mm; Height: 0.45mm; Depth: 0.8mm; Lead Free: Lead Free; Military Standard: Not; RoHS Compliant: Yes; ComponentLink1URL: https://datasheet.ciiva.com/11819/0900766b80c66297-11819716.pdf?src-supplier=Rs; ComponentLink1Description: https://datasheet.ciiva.com/11819/0900766b80c66297-11819716.pdf?src-supplier=Rs; ComponentLink2URL: https://datasheet.ciiva.com/15189/getdatasheetpartid-326529-15189837.pdf?src-supplier=Verical; ComponentLink2Description: https://datasheet.ciiva.com/15189/getdatasheetpartid-326529-15189837.pdf?src-supplier=Verical; Supplier Part Number 1: 1365832; Supplier: LCSC; Supplier Part Number: C137671; Value: 91k; ComponentLink3Description: LCSC; ComponentLink3URL: https://www.lcsc.com/product-detail/Chip-Resistor-Surface-Mount_YAGEO-RC0603FR-0791KL_C137671.html
R10-R17 = RC0603FR-0775RL: SMD Chip Resistor, 75 Ohm, ± 1%, 100 mW, 0603 [1608 Metric], Thick Film, General Purpose; Manufacturer: Yageo; Resistance: 75R; Temperature Coefficient: 100ppm/°C; Power Rating: 100mW; Voltage Rating: 50V; Value: 75R; Supplier 1: Future Electronics; Manufacturer Part Number: RC0603FR-0775RL; RoHS: Yes; Category: Chip SMD Resistors; Stock 1: 775000; Pricing 1: 5000=0.0014, 50000=0.0013, 200000=0.0012, 625000=0.0012, 2000000=0.0011 (USD); Case/Package: 0603; Case Code (Metric): 1608; Case Code (Imperial): 0603; Size Code: 0603; Min Operating Temperature: -55°C; Max Operating Temperature: 155°C; Tolerance: 1%; Resistor Type: Thick Film; Package Quantity: 1; Packaging: Tape and Reel; Number of Terminations: 2; Termination: SMD/SMT; Max Power Dissipation: 100mW; Features: Moisture Resistant; Series: RC; Resistance Tolerance: 1%; Construction: Rectangular; Technology: THICK FILM; Voltage Rating (DC): 50V; Length: 0.063inch; Width: 0.031inch; Height: 0.022inch; Depth: 0.8mm; Reach SVHC Compliant: No; Military Standard: Not; RoHS Compliant: Yes; Lead Free: 5697LeadFree; ComponentLink1URL: https://datasheet.ciiva.com/11819/0900766b80f96399-11819407.pdf?src-supplier=Rs; ComponentLink1Description: https://datasheet.ciiva.com/11819/0900766b80f96399-11819407.pdf?src-supplier=Rs; ComponentLink2URL: https://datasheet.ciiva.com/46395/443971-46395018.pdf?src-supplier=Element14; ComponentLink2Description: https://datasheet.ciiva.com/46395/443971-46395018.pdf?src-supplier=Element14; ComponentLink3URL: https://datasheet.ciiva.com/2453/pyu-r-int-thick-7-2453962.pdf?src-supplier=Digi-Key; ComponentLink3Description: https://datasheet.ciiva.com/2453/pyu-r-int-thick-7-2453962.pdf?src-supplier=Digi-Key; ComponentLink4URL: https://datasheet.ciiva.com/2453/pyu-r-int-thick-7-2453963.pdf?src-supplier=Digi-Key; ComponentLink4Description: https://datasheet.ciiva.com/2453/pyu-r-int-thick-7-2453963.pdf?src-supplier=Digi-Key; ComponentLink5URL: https://datasheet.ciiva.com/2453/pyu-r-int-thick-7-2453961.pdf?src-supplier=Digi-Key; ComponentLink5Description: https://datasheet.ciiva.com/2453/pyu-r-int-thick-7-2453961.pdf?src-supplier=Digi-Key; Supplier Part Number 1: 4693131; Supplier: LCSC; Supplier Part Number: C112309; ComponentLink6Description: LCSC; ComponentLink6URL: https://www.lcsc.com/product-detail/Chip-Resistor-Surface-Mount_YAGEO-RC0603FR-0775RL_C112309.html
R20 = RC0603FR-078K2L: Res Thick Film 0603 8.2K Ohm 1% 0.1W(1/10W) ±100ppm/C Pad SMD T/R; Manufacturer: Yageo; Resistance: 8.2kR; Voltage Rating (DC): 50V; Temperature Coefficient: 100ppm/°C; Power Rating: 100mW; Value: 10kR; Supplier 1: Future Electronics; Manufacturer Part Number: RC0603FR-078K2L; RoHS: Yes; Category: Chip SMD Resistors; Stock 1: 690000; Pricing 1: 5000=0.0015, 50000=0.0014, 150000=0.0014, 375000=0.0013, 1000000=0.0012 (USD); Case/Package: 0603; Number of Pins: 2; Case Code (Metric): 1608; Case Code (Imperial): 0603; Size Code: 0603; Min Operating Temperature: -55°C; Max Operating Temperature: 155°C; Tolerance: 1%; Packaging: Tape and Reel; Resistor Type: Thick Film; Voltage Rating: 50V; Package Quantity: 1; Number of Terminations: 2; Termination: SMD/SMT; Max Power Dissipation: 100mW; Features: Moisture Resistant; Series: RC; Resistance Tolerance: 1%; Technology: THICK FILM; Voltage Rating (AC): 50V; Length: 0.063inch; Width: 0.031inch; Height: 0.022inch; Depth: 0.8mm; Lead Pitch: 0.3mm; Reach SVHC Compliant: No; Lead Free: 5697LeadFree; RoHS Compliant: Yes; ComponentLink1URL: https://datasheet.ciiva.com/11808/0900766b80f96399-11808128.pdf?src-supplier=Rs; ComponentLink1Description: https://datasheet.ciiva.com/11808/0900766b80f96399-11808128.pdf?src-supplier=Rs; ComponentLink2URL: https://datasheet.ciiva.com/7746/443971-7746409.pdf?src-supplier=Element14; ComponentLink2Description: https://datasheet.ciiva.com/7746/443971-7746409.pdf?src-supplier=Element14; ComponentLink3URL: https://datasheet.ciiva.com/7746/443971-7746408.pdf?src-supplier=Element14; ComponentLink3Description: https://datasheet.ciiva.com/7746/443971-7746408.pdf?src-supplier=Element14; ComponentLink4URL: https://datasheet.ciiva.com/7660/38590-7660795.pdf?src-supplier=Element14; ComponentLink4Description: https://datasheet.ciiva.com/7660/38590-7660795.pdf?src-supplier=Element14; ComponentLink5URL: https://datasheet.ciiva.com/46412/443971-46412857.pdf?src-supplier=Element14; ComponentLink5Description: https://datasheet.ciiva.com/46412/443971-46412857.pdf?src-supplier=Element14; ComponentLink6URL: https://datasheet.ciiva.com/2454/pyu-r-int-thick-7-2454253.pdf?src-supplier=Digikey; ComponentLink6Description: https://datasheet.ciiva.com/2454/pyu-r-int-thick-7-2454253.pdf?src-supplier=Digikey; ComponentLink7URL: https://datasheet.ciiva.com/2454/pyu-r-int-thick-7-2454254.pdf?src-supplier=Digikey; ComponentLink7Description: https://datasheet.ciiva.com/2454/pyu-r-int-thick-7-2454254.pdf?src-supplier=Digikey; ComponentLink8URL: https://datasheet.ciiva.com/2454/pyu-r-int-thick-7-2454252.pdf?src-supplier=Digikey; ComponentLink8Description: https://datasheet.ciiva.com/2454/pyu-r-int-thick-7-2454252.pdf?src-supplier=Digikey; Supplier Part Number 1: 9121856; Supplier: LCSC; Supplier Part Number: C114637; ComponentLink9Description: LCSC; ComponentLink9URL: https://www.lcsc.com/product-detail/Chip-Resistor-Surface-Mount_YAGEO-RC0603FR-078K2L_C114637.html
T1 = 7490220122: WE-LAN 10/100/1000 Base-T SMT Transformer 1 Port; Manufacturer: Wurth Electronics; Inductance: 350uH; Turns Ratio: 1:1; Supplier 1: Digi-Key; Manufacturer Part Number: 7490220122; RoHS: Yes; Category: Transformers; Stock 1: 8221; Pricing 1: 1=6.98, 10=6.731, 50=6.321, 100=5.951 (USD); Mount: Surface Mount; Min Operating Temperature: -40°C; Max Operating Temperature: 85°C; Packaging: Cut Tape; Series: WE-LAN; RoHS Compliant: Yes; ComponentLink1URL: http://www.farnell.com/datasheets/2616617.pdf?src-supplier=Farnell; ComponentLink1Description: http://www.farnell.com/datasheets/2616617.pdf?src-supplier=Farnell; ComponentLink2URL: http://www.farnell.com/datasheets/2616617.pdf?src-supplier=Newark; ComponentLink2Description: http://www.farnell.com/datasheets/2616617.pdf?src-supplier=Newark; ComponentLink3URL: https://katalog.we-online.de/pbs/datasheet/7490220122.pdf?src-supplier=Digi-Key; ComponentLink3Description: https://katalog.we-online.de/pbs/datasheet/7490220122.pdf?src-supplier=Digi-Key; Supplier Part Number 1: 732-10731-1-ND
TP1 TP6-TP11 = Test_Point
U1 = AG5800: IEEE802.3bt 4-Pair PD Module - works with AG6800; Manufacturer: Silvertel; Supplier 1: Digi-Key; Manufacturer Part Number: AG5800; RoHS: No; Stock 1: 862; Pricing 1: 1=25.36, 10=24.65, 24=23.92, 48=23.2, 120=22.47, 264=22.00008 (USD); Supplier Part Number 1: 5061-AG5800-ND
U2 U5 = LM5050MK-1/NOPB: IC OR CTRLR N+1 6SOT; Manufacturer: TI National Semiconductor; Min Supply Voltage: 5V; Max Supply Voltage: 75V; Number of Outputs: 1; Turn-Off Delay Time: 486ns; Quiescent Current: 400uA; Nominal Supply Current: 130uA; Output Current: 3.2uA; Supplier 1: Digi-Key; Manufacturer Part Number: LM5050MK-1/NOPB; RoHS: Yes; Category: Power Management ICs; Pricing 1: 1=2.85000, 10=2.55900, 25=2.41400, 100=2.05690, 250=1.93132, 500=1.68990 (USD); Mount: Surface Mount; Case/Package: SOT-23-6; Number of Pins: 6; Contact Plating: Tin; Weight: 0.00127oz; Min Operating Temperature: -40°C; Max Operating Temperature: 125°C; Series: -; Packaging: Tape and Reel; Package Quantity: 1000; Number of Drivers: 1; Operating Supply Current: 130uA; Supply Current: 130uA; Output Voltage: 75V; Max Output Current: 3.2uA; Radiation Hardening: No; Lead Free: Lead Free; RoHS Compliant: Yes; Reach SVHC Compliant: Yes; ComponentLink1URL: https://datasheet.ciiva.com/22694/1642225-22694320.pdf?src-supplier=Element14; ComponentLink1Description: https://datasheet.ciiva.com/22694/1642225-22694320.pdf?src-supplier=Element14; ComponentLink2URL: https://datasheet.ciiva.com/12085/lm5050-1-122886-12085154.pdf?src-supplier=Mouser; ComponentLink2Description: https://datasheet.ciiva.com/12085/lm5050-1-122886-12085154.pdf?src-supplier=Mouser; ComponentLink3URL: https://datasheet.ciiva.com/15110/getdatasheetpartid-319925-15110173.pdf?src-supplier=Verical; ComponentLink3Description: https://datasheet.ciiva.com/15110/getdatasheetpartid-319925-15110173.pdf?src-supplier=Verical; ComponentLink4URL: https://datasheet.ciiva.com/1960/lm5050-1-1960856.pdf?src-supplier=Digi-Key; ComponentLink4Description: https://datasheet.ciiva.com/1960/lm5050-1-1960856.pdf?src-supplier=Digi-Key; ComponentLink5URL: https://datasheet.ciiva.com/1960/lm5050-1-1960857.pdf?src-supplier=Digi-Key; ComponentLink5Description: https://datasheet.ciiva.com/1960/lm5050-1-1960857.pdf?src-supplier=Digi-Key; ComponentLink6URL: https://datasheet.ciiva.com/1960/lm5050-1-1960858.pdf?src-supplier=Digi-Key; ComponentLink6Description: https://datasheet.ciiva.com/1960/lm5050-1-1960858.pdf?src-supplier=Digi-Key; Supplier Part Number 1: LM5050MK-1/NOPBDKR-ND
U3 U4 U6-U8 = OR-3H7B-TP-G: 80V 3750V 50mA 0.4V@2.4mA,8mA 1 6V 1.2V DC SOP-4-1.27mm Optocouplers - Phototransistor Output ROHS; Manufacturer: Orient; Manufacturer Part Number: OR-3H7B-TP-G; Supplier: LCSC; Supplier Part Number: C282477; Value: 80V 3750V 50mA; ComponentLink1Description: LCSC; ComponentLink1URL: https://www.lcsc.com/product-detail/Optocouplers-Phototransistor-Output_Orient-OR-3H7B-TP-G_C282477.html

## Assembly variants
assembly: not fitted R2 R20